# EAGLE design thermowut (EAGLE 5.11)
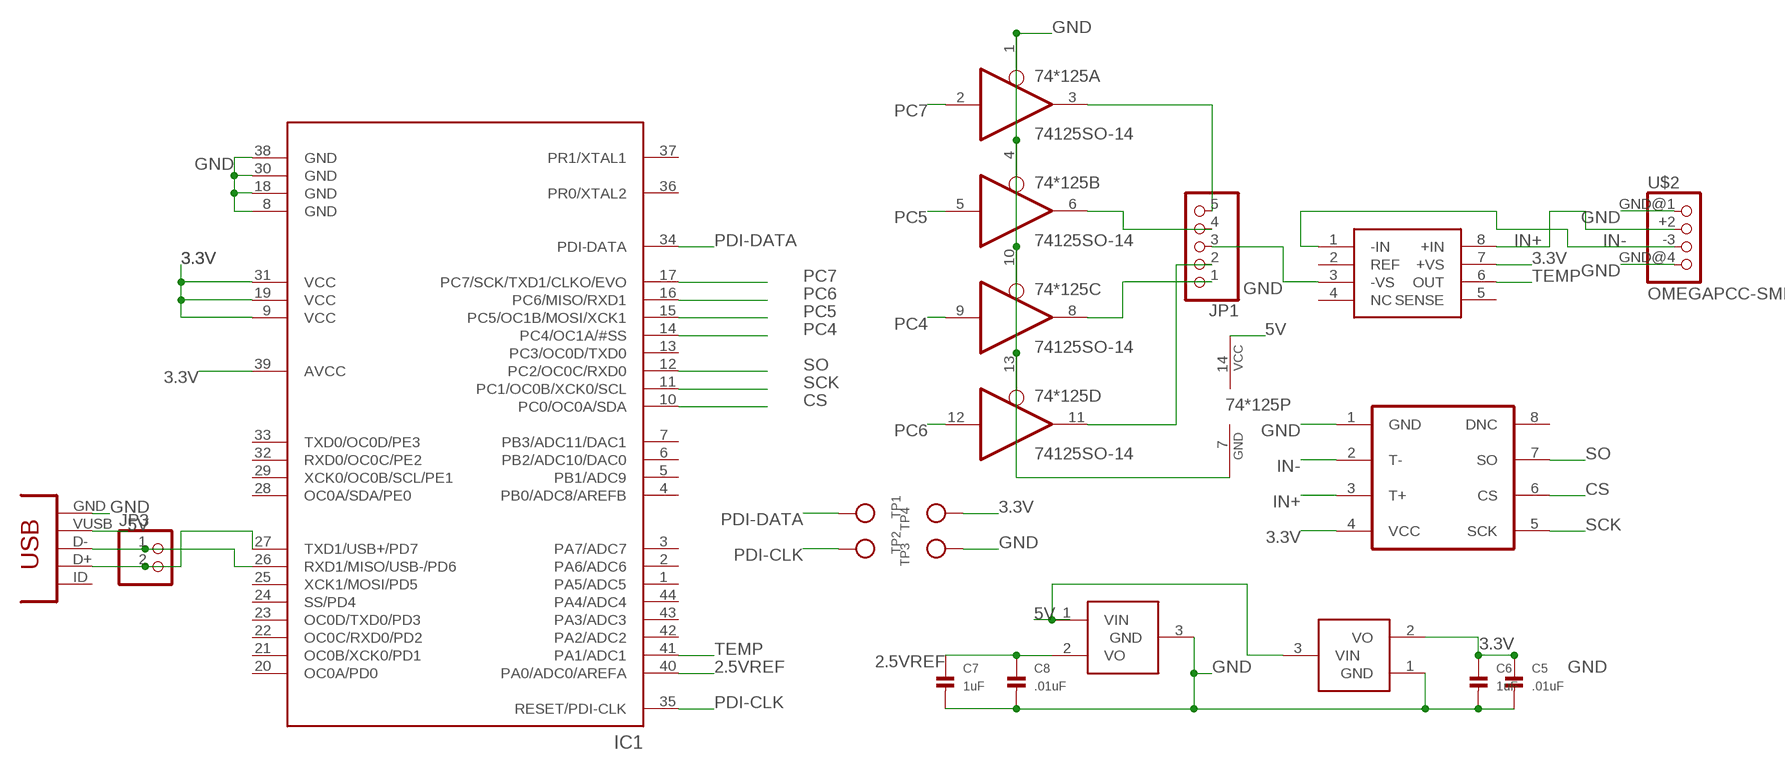
[diagram p0: schematic, sheet 1]

## Parts
2.5V  VREF  [SOT23-3]
3.3V  VREG  [SOT23-3]
74*125  74125SO-14  [SO-14]
C5  .01uF  CAP_CERAMIC0603  [0603]
C6  1uF  CAP_CERAMIC0603  [0603]
C7  1uF  CAP_CERAMIC0603  [0603]
C8  .01uF  CAP_CERAMIC0603  [0603]
IC1  ATXMEGAXXA4U  [TQFP-44]
JP1  HEADER-1X5SMT  [1X05_SMT]
JP3  HEADER-1X2ROUND  [1X02_ROUND]
K-TYPE  AD8495  [MSOP08]
TP1  TESTPOINTROUND2MM  [TESTPOINT_ROUND_2MM]
TP2  TESTPOINTROUND2MM  [TESTPOINT_ROUND_2MM]
TP3  TESTPOINTROUND2MM  [TESTPOINT_ROUND_2MM]
TP4  TESTPOINTROUND2MM  [TESTPOINT_ROUND_2MM]
U$1  MAX31855  [SO-08]
U$2  OMEGAPCC-SMP  [PCC-SMP]
USB1  USB-MINI-BUSB1  [CONN_USB_MINI-B]

## Nets
2.5VREF: 2.5V.2(VO) C7.1 C8.1 IC1.40(PA0/ADC0/AREFA)
3.3V: 3.3V.2(VO) C5.1 C6.1 IC1.9(VCC) IC1.19(VCC) IC1.31(VCC) IC1.39(AVCC) K-TYPE.7(+VS) TP4.P$1 U$1.4(VCC)
5V: 2.5V.1(VIN) 3.3V.3(VIN) 74*125.14(P:VCC) USB1.VUSB
CS: IC1.10(PC0/OC0A/SDA) U$1.6(CS)
D+: IC1.27(TXD1/USB+/PD7) JP3.2 USB1.D+
D-: IC1.26(RXD1/MISO/USB-/PD6) JP3.1 USB1.D-
GND: 2.5V.3(GND) 3.3V.1(GND) 74*125.1(A:OE) 74*125.4(B:OE) 74*125.7(P:GND) 74*125.10(C:OE) 74*125.13(D:OE) C5.2 C6.2 C7.2 C8.2 IC1.8(GND) IC1.18(GND) IC1.30(GND) IC1.38(GND) JP1.3 K-TYPE.3(-VS) TP3.P$1 U$1.1(GND) U$2.GND@1 U$2.GND@4 USB1.GND
IN+: K-TYPE.8(+IN) U$1.3(T+) U$2.+2
IN-: K-TYPE.1(-IN) U$1.2(T-) U$2.-3
OUTA: 74*125.3(A:O) JP1.5
OUTB: 74*125.6(B:O) JP1.4
OUTC: 74*125.8(C:O) JP1.1
OUTD: 74*125.11(D:O) JP1.2
PC4: 74*125.9(C:I) IC1.14(PC4/OC1A/#SS)
PC5: 74*125.5(B:I) IC1.15(PC5/OC1B/MOSI/XCK1)
PC6: 74*125.12(D:I) IC1.16(PC6/MISO/RXD1)
PC7: 74*125.2(A:I) IC1.17(PC7/SCK/TXD1/CLKO/EVO)
PDI-CLK: IC1.35(RESET/PDI-CLK) TP2.P$1
PDI-DATA: IC1.34(PDI-DATA) TP1.P$1
SCK: IC1.11(PC1/OC0B/XCK0/SCL) U$1.5(SCK)
SO: IC1.12(PC2/OC0C/RXD0) U$1.7(SO)
TEMP: IC1.41(PA1/ADC1) K-TYPE.6(OUT)
Unconnected: IC1.1(PA5/ADC5) IC1.2(PA6/ADC6) IC1.3(PA7/ADC7) IC1.4(PB0/ADC8/AREFB) IC1.5(PB1/ADC9) IC1.6(PB2/ADC10/DAC0) IC1.7(PB3/ADC11/DAC1) IC1.13(PC3/OC0D/TXD0) IC1.20(OC0A/PD0) IC1.21(OC0B/XCK0/PD1) IC1.22(OC0C/RXD0/PD2) IC1.23(OC0D/TXD0/PD3) IC1.24(SS/PD4) IC1.25(XCK1/MOSI/PD5) IC1.28(OC0A/SDA/PE0) IC1.29(XCK0/OC0B/SCL/PE1) IC1.32(RXD0/OC0C/PE2) IC1.33(TXD0/OC0D/PE3) IC1.36(PR0/XTAL2) IC1.37(PR1/XTAL1) IC1.42(PA2/ADC2) IC1.43(PA3/ADC3) IC1.44(PA4/ADC4) K-TYPE.2(REF) K-TYPE.4(NC) K-TYPE.5(SENSE) U$1.8(DNC) USB1.BODY@1(BODY) USB1.BODY@2(BODY) USB1.BODY@3(BODY) USB1.BODY@4(BODY) USB1.ID(USBID)

## Library data of the parts
2.5V = nonolith:VREF
3.3V = nonolith:VREG
74*125 = nonolith:74*125: Quad bus BUFFER, 3-state
C5-C8 = nonolith:CAP_CERAMIC: Ceramic Capacitors 0402 - 0402 Surface Mount Capacitors 0.1uF 10V 10% [Digikey: 490-1318-2-ND] 0603 - 0603 Surface Mount Capacitors 16 pF 50V 5% [Digikey: 445-5051-2-ND] 22 pF 50V [Digikey: PCC220ACVTR-ND] 33 pF 50V 5% [Digikey: 490-1415-1-ND] 56pF 50V 5% [Digikey: 490-1421-1-ND] 220pF 50V 5% [Digikey: 445-1285-1-ND] 680 pF 50V 2200 pF 50V 5% C0G [Digikey: 445-1297-1-ND] 5600 pF 100V 5% X7R [Digikey: 478-3711-1-ND] 0.1 µF 25V 10% [Digikey: PCC2277TR-ND] 0.22 µF 16V 10% X7R [Digikey: 445-1318-1-ND] 1.0 µF 25V 10% [Digikey: 445-5146-2-ND] 0603 - RF Specific 3pF 250V +/-0.1pF RF [Digikey: 712-1347-1-ND] 18 pF 250V 5% [Digikey: 478-3505-1-ND or 712-1322-1-ND] 56 pF 250V 5% C0G RF [Digikey: 490-4867-1-ND] 68 pF 250V RF [Digikey: 490-4868-1-ND] 0805 - 0805 Surface Mount Capacitors 220 pF 250V 2% RF Ceramic Capacitor [Digikey: 712-1398-1-ND] 1000 pF 50V 2% NP0 Ceramic Capacitor [Digikey: 478-3760-1-ND] 0.1 µF 25V 10% Ceramic Capacitor [Digikey: PCC1828TR-ND] 1.0 µF 16V 10% Ceramic Capacitor[Digikey: 490-1691-2-ND] 10.0 µF 10V 10% Ceramic Capacitor[Digikey: 709-1228-1-ND] 1206 - 1206 Surface Mount Capacitors
IC1 = nonolith:ATXMEGAXXA4U: ATXMEGA A4U Series (XMEGA+USB)
JP1 = nonolith:HEADER-1X5: PIN HEADER
JP3 = nonolith:HEADER-1X2: PIN HEADER
K-TYPE = SparkFun:AD8495: AD8495 Precision Thermocouple Amplifier with Cold Junction Compensation http://www.analog.com/static/imported-files/data_sheets/AD8494_8495_8496_8497.pdf
TP1-TP4 = microbuilder:TESTPOINT: Test Point TESTPOINT_SMT - Compact Surface Mount Test Point [Digikey: 5016KTR-ND] TESTPOINT_PAD - Square Pad (2mm) TESTPOINT_SMT - Round Pad (2mm) TESTPOINT_0.1" - 0.1" Header
U$1 = nonolith:MAX31855: MAX31855 thermocouple interface
U$2 = nonolith:OMEGA
USB1 = nonolith:USB-MINI-B: USB connector

## Net classes
0 default: width 0.254 mm, clearance 0.127 mm

## Board
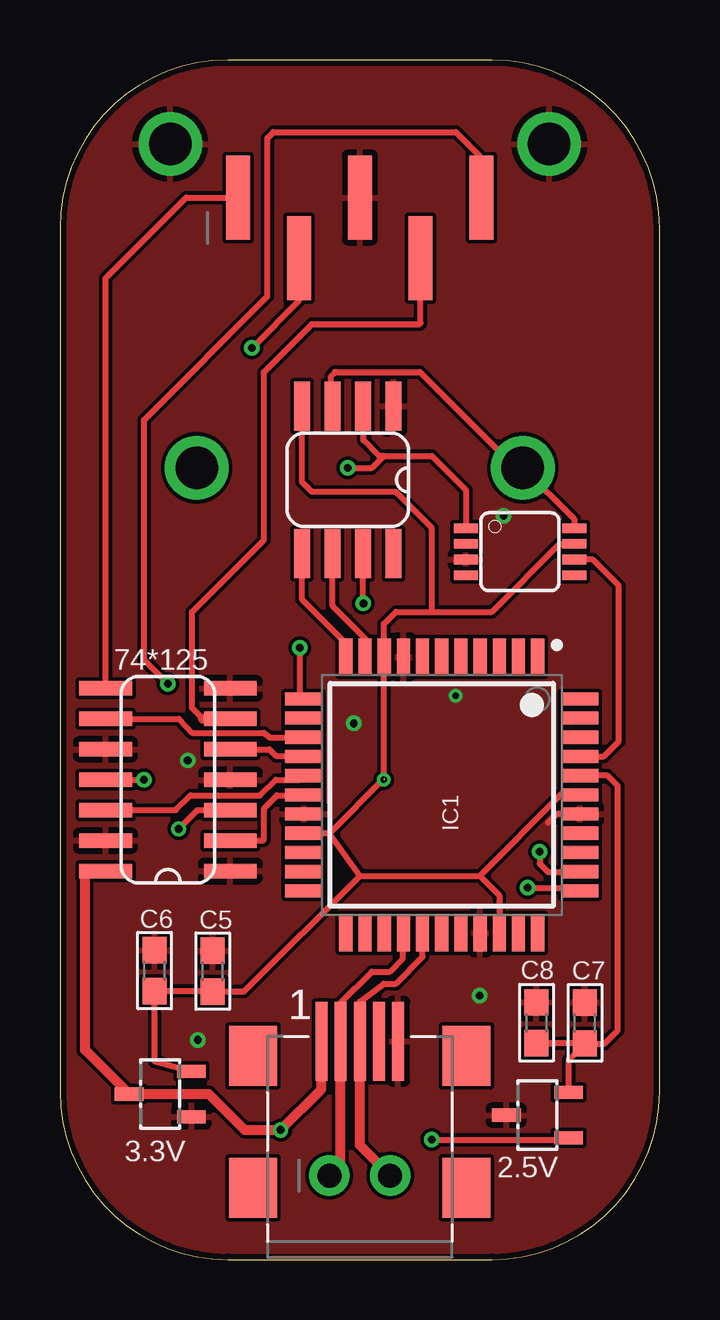
[diagram p1: board, top side]
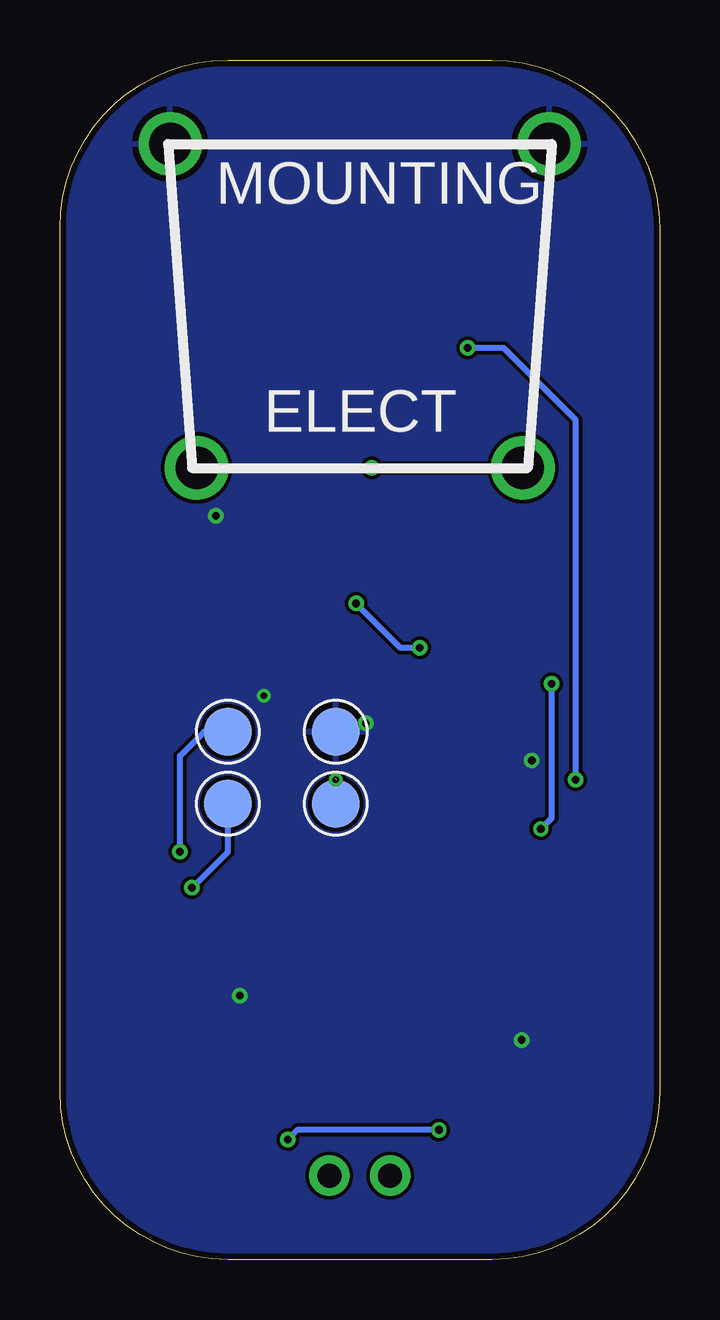
[diagram p2: board, bottom side, seen from below]

Size 25 x 50 mm. Coordinates in mm from the lower left corner, seen from the top.
Outline: 25,43 arc90 18,50 7,50 arc90 0,43 0,7 arc90 7,0 18,0 arc90 25,7 25,43
Copper layers (1*16): Top 0.035mm / dielectric 1.5mm / Bottom 0.035mm
Design rules "Fusion_eagle_rule_v1.1": minimum track width 6mil, minimum drill 12mil, track to track 6mil, track to pad 6mil, pad to pad 6mil, via to via 6mil, smd to smd 0mil, copper to edge 10mil, drill to drill 10mil, minimum pad ring 10mil, minimum via ring 6mil, stop-mask expansion 2mil, vias tented up to drill 100mil, thermal gap 10mil

### Footprints (pad centres in the part's own frame; a part is rotated, then mirrored left to right if it is on the bottom)
SOT23-3 = smd 0.55 x 1.2: 1 0.95,1.3; 2 -0.95,1.3; 3 0,-1.3
SO-14 = smd 0.6 x 2.2: 1 -3.81,-2.6; 2 -2.54,-2.6; 3 -1.27,-2.6; 4 0,-2.6; 5 1.27,-2.6; 6 2.54,-2.6; 7 3.81,-2.6; 8 3.81,2.6; 9 2.54,2.6; 10 1.27,2.6; 11 0,2.6; 12 -1.27,2.6; 13 -2.54,2.6; 14 -3.81,2.6
0603 = smd 1.1 x 1: 1 -0.85,0; 2 0.85,0
TQFP-44 = smd 1.55 x 0.55: 1 -5.75,4; 2 -5.75,3.2; 3 -5.75,2.4; 4 -5.75,1.6; 5 -5.75,0.8; 6 -5.75,0; 7 -5.75,-0.8; 8 -5.75,-1.6; 9 -5.75,-2.4; 10 -5.75,-3.2; 11 -5.75,-4; 23 5.75,-4; 24 5.75,-3.2; 25 5.75,-2.4; 26 5.75,-1.6; 27 5.75,-0.8; 28 5.75,0; 29 5.75,0.8; 30 5.75,1.6; 31 5.75,2.4; 32 5.75,3.2; 33 5.75,4 | smd 0.55 x 1.55: 12 -4,-5.75; 13 -3.2,-5.75; 14 -2.4,-5.75; 15 -1.6,-5.75; 16 -0.8,-5.75; 17 0,-5.75; 18 0.8,-5.75; 19 1.6,-5.75; 20 2.4,-5.75; 21 3.2,-5.75; 22 4,-5.75; 34 4,5.75; 35 3.2,5.75; 36 2.4,5.75; 37 1.6,5.75; 38 0.8,5.75; 39 0,5.75; 40 -0.8,5.75; 41 -1.6,5.75; 42 -2.4,5.75; 43 -3.2,5.75; 44 -4,5.75
1X05_SMT = smd 1 x 3.5: 1 -5.08,1.27; 2 -2.54,-1.27; 3 0,1.27; 4 2.54,-1.27; 5 5.08,1.27
1X02_ROUND = drill 1 pad 1.676 round: 1 -1.27,0; 2 1.27,0
MSOP08 = smd 0.4 x 1: 1 -0.976,-2.263; 2 -0.326,-2.263; 3 0.324,-2.263; 4 0.974,-2.263; 5 0.974,2.262; 6 0.324,2.262; 7 -0.326,2.262; 8 -0.976,2.262
TESTPOINT_ROUND_2MM = smd 2 x 2: P$1 0,0
SO-08 = smd 0.66 x 2.032: 1 -1.905,-3.073; 2 -0.635,-3.073; 3 0.635,-3.073; 4 1.905,-3.073; 5 1.905,3.073; 6 0.635,3.073; 7 -0.635,3.073; 8 -1.905,3.073
PCC-SMP = drill 1.77 round: +2 -6.8,0; -3 6.8,0; GND@1 -7.9,13.5; GND@4 7.9,13.5
CONN_USB_MINI-B = smd 2 x 2.5: BODY@1 -4.45,2.5; BODY@2 4.45,2.5; BODY@3 4.45,-3; BODY@4 -4.45,-3 | smd 0.5 x 3.3: D+ 0,3.1; D- -0.8,3.1; GND 1.6,3.1; ID 0.8,3.1; VUSB -1.6,3.1

### Placement (x,y rotation side)
2.5V  19.91,6.02 270 top
3.3V  4.18,6.9 270 top
74*125  4.5,20 90 top
C5  6.37,12.02 90 top
C6  3.94,12.04 90 top
C7  21.89,9.86 90 top
C8  19.87,9.87 90 top
IC1  15.92,19.37 270 top
JP1  12.5,43 0 top
JP3  12.5,3.5 0 top
K-TYPE  19.18,29.5 270 top
TP1  18,19 0 bottom
TP2  18,22 0 bottom
TP3  13.5,22 0 bottom
TP4  13.5,19 0 bottom
U$1  12,32.5 180 top
U$2  12.5,33 0 bottom
USB1  12.5,6 0 top

### Tracks (layer width: path | path; a pad name or v marks a point on that pad's centre or on a via)
2.5VREF
  Top 0.254: 20.5,9 20.48,9.02 C8.1 C7.1 | 2.5V.2 21.21,8.33 C7.1 | C7.1 22.7,9 23.25,9.55 23.25,19.75 22.83,20.17 IC1.40
3.3V  (via drill 0.25)  (1 unrouted)
  Top 0.254: 3.3V.2 3.94,8.27 C6.1 | C6.1 3.96,11.17 | C6.1 6.35,11.19 C5.1 7.67,11.17 12.5,16 | 11.23,17.77 IC1.19 | 12.5,16 11.23,17.77 | IC1.31 18.32,15.18 17.5,16 | 12.5,16 17.5,16 | IC1.39 20.87,19.37 17.5,16 | 15.5,27 14,27 13.5,26.5 13.5,25.14 IC1.9 13.52,20.06 11.23,17.77 | U$1.4 10.1,32.41 10.5,32 14,32 15.5,30.5 15.5,27 | K-TYPE.7 20.83,29.83 18,27 15.5,27
  Bottom 0.254: TP4.P$1 v13.5,20
5V  (via drill 0.33)
  Top 0.254: v15.5,5 21.14,5 2.5V.1
  Top 0.406: USB1.VUSB 10.9,7.1 v9.2,5.4 7.7,5.4 6.2,6.9 3.3V.3 1.05,8.73 1.05,16.2 1.06,16.19 74*125.14
  Bottom 0.254: v9.2,5.4 15.1,5.4 v15.5,5
CS
  Top 0.254: U$1.6 11.37,27.23 12.75,25.85 12.75,25.15 IC1.10
D+
  Top 0.254: 15,13.5 IC1.27 15.12,12.62 14,11.5 13.5,11.5 12.5,10.75 USB1.D+
  Top 0.406: USB1.D+ 12.5,4.77 JP3.2
D-
  Top 0.254: USB1.D- 11.7,10.7 13,12 13.75,12 14.3,12.55 14.3,13.6 IC1.26
  Top 0.406: USB1.D- 11.7,3.97 JP3.1
GND  (via drill 0.25, 0.33)
  Top 0.254: IC1.38 20.72,18.57 20.35,18.2
  other vias: 18.5,31 5.33,20.8 5.75,9.15 17.5,11 12.25,22.35 16.5,23.5
  pour Top: 0,50 25,50 25,0 0,0
  pour Bottom: 25,50 0,50 0,0 25,0
IN+
  Top 0.254: 11.5,37 11.45,37 | 11.5,37 15,37 19,33 U$2.+2 21.44,30.86 K-TYPE.8 | U$1.3 11.3,35.64 11.3,36.8 11.5,37
IN-  (via drill 0.33)
  Top 0.254: K-TYPE.1 16.92,32.08 15.5,33.5 13.5,33.5 | U$1.2 12.5,35.44 12.65,35.29 12.65,34.15 13.3,33.5 13.5,33.5 | v12,33 13,33 13.5,33.5
  Bottom 0.254: U$2.-3 v12,33
OUTA  (via drill 0.33)
  Top 0.254: 74*125.3 5.73,18.73 v4.95,17.95 | v4.5,24 3.5,25 3.5,35 8.65,40.15 8.65,46.75 8.9,47 16.5,47 17.5,46 17.5,45 17.58,44.92 JP1.5
  Bottom 0.254: v4.5,24 4.5,18.4 v4.95,17.95
OUTB
  Top 0.254: 74*125.6 7.06,22.5 6,22.5 | 5.96,22.54 5.5,23 5.5,27 8.5,30 8.5,37 10.5,39 15,39 15.04,39.04 JP1.4
  Top 0.406: 74*125.6 5.96,22.54
OUTC
  Top 0.254: 74*125.8 1.9,40.9 5.27,44.27 JP1.1
OUTD  (via drill 0.33)
  Top 0.254: 74*125.11 v3.5,20 | JP1.2 9.96,39.96 v8,38
  Bottom 0.254: v3.5,20 3.5,35 6.5,38 v8,38
PC4
  Top 0.254: 74*125.9 4.96,22.54 5.5,21.95 8.5,21.95 8.73,21.77 IC1.14
PC5
  Top 0.254: 10.15,20.95 IC1.15 10.14,21 9,21 8.73,21.27 74*125.5
PC6
  Top 0.254: 74*125.12 4.83,18.73 5.45,19.35 8.35,19.35 9,20 10,20 IC1.16
PC7
  Top 0.254: 74*125.2 8.46,17.46 8.5,17.5 8.5,18.8 9.05,19.35 10.09,19.35 IC1.17
PDI-CLK  (via drill 0.33)
  Top 0.254: 21.5,16 IC1.35 21.65,16.15 20.35,16.15 20,16.5 v20,17
  Bottom 0.254: TP2.P$1 19,22 20,21 v20,17
PDI-DATA  (via drill 0.33)
  Top 0.254: v19.5,15.5 21.54,15.5 IC1.34
  Bottom 0.254: v19.5,15.5 18,17 TP1.P$1
SCK
  Top 0.254: U$1.5 10.1,27.5 11.95,25.65 11.95,25.15 IC1.11
SO  (via drill 0.33)
  Top 0.254: IC1.12 10,23.37 v10,25.5 | U$1.7 12.63,27.36 v12.65,27.35
  Bottom 0.254: v10,25.5 10.8,25.5 v12.65,27.35
TEMP
  Top 0.254: IC1.41 22.67,20.97 23.3,21.6 23.3,28.1 22.22,29.18 K-TYPE.6